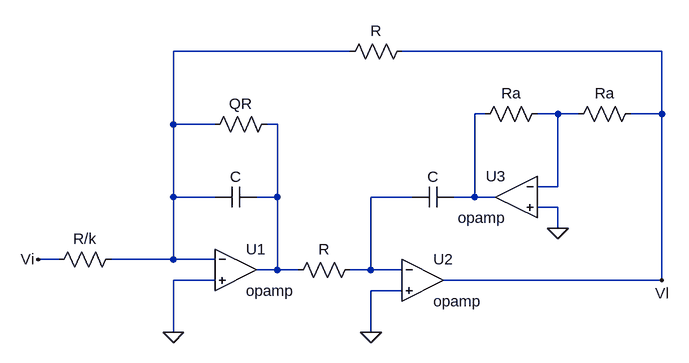
[diagram p0: schematic ackerberg_mossberg.asc]
ackerberg_mossberg.asc, the LTspice schematic file:
Version 4
SHEET 1 880 680
WIRE 192 -144 -80 -144
WIRE 672 -144 272 -144
WIRE 400 -48 384 -48
WIRE 512 -48 480 -48
WIRE 544 -48 512 -48
WIRE 672 -48 672 -144
WIRE 672 -48 624 -48
WIRE -80 -32 -80 -144
WIRE -16 -32 -80 -32
WIRE 80 -32 64 -32
WIRE 512 64 512 -48
WIRE 512 64 480 64
WIRE -80 80 -80 -32
WIRE -16 80 -80 80
WIRE 80 80 80 -32
WIRE 80 80 48 80
WIRE 288 80 224 80
WIRE 384 80 384 -48
WIRE 384 80 352 80
WIRE 416 80 384 80
WIRE 512 96 480 96
WIRE 512 128 512 96
WIRE -256 176 -288 176
WIRE -80 176 -80 80
WIRE -80 176 -176 176
WIRE -16 176 -80 176
WIRE 80 192 80 80
WIRE 80 192 48 192
WIRE 112 192 80 192
WIRE 224 192 224 80
WIRE 224 192 192 192
WIRE 272 192 224 192
WIRE -16 208 -80 208
WIRE 672 208 672 -48
WIRE 672 208 336 208
WIRE 272 224 224 224
WIRE -80 288 -80 208
WIRE 224 288 224 224
FLAG 224 288 0
FLAG -80 288 0
FLAG 672 208 Vl
FLAG -288 176 Vi
FLAG 512 128 0
SYMBOL Opamps\\opamp 16 128 R0
SYMATTR InstName U1
SYMBOL Opamps\\opamp 304 144 R0
SYMATTR InstName U2
SYMBOL Opamps\\opamp 448 16 M0
SYMATTR InstName U3
SYMBOL cap 48 64 R90
WINDOW 0 0 32 VBottom 2
WINDOW 3 32 32 VTop 2
SYMATTR InstName C
SYMATTR Value ""
SYMBOL res 80 -48 R90
WINDOW 0 0 56 VBottom 2
WINDOW 3 32 56 VTop 2
SYMATTR InstName QR
SYMATTR Value ""
SYMBOL res -160 160 R90
WINDOW 0 0 56 VBottom 2
WINDOW 3 32 56 VTop 2
SYMATTR InstName R/k
SYMATTR Value ""
SYMBOL res 208 176 R90
WINDOW 0 0 56 VBottom 2
WINDOW 3 32 56 VTop 2
SYMATTR InstName R
SYMATTR Value ""
SYMBOL res 496 -64 R90
WINDOW 0 0 56 VBottom 2
WINDOW 3 32 56 VTop 2
SYMATTR InstName Ra
SYMATTR Value ""
SYMBOL res 640 -64 R90
WINDOW 0 0 56 VBottom 2
WINDOW 3 32 56 VTop 2
SYMATTR InstName Ra
SYMATTR Value ""
SYMBOL res 288 -160 R90
WINDOW 0 0 56 VBottom 2
WINDOW 3 32 56 VTop 2
SYMATTR InstName R
SYMATTR Value ""
SYMBOL cap 352 64 R90
WINDOW 0 0 32 VBottom 2
WINDOW 3 32 32 VTop 2
SYMATTR InstName C
SYMATTR Value ""

The netlist it stands for:
* ackerberg_mossberg.asc
XU1 N001 0 N004 opamp Aol=100K GBW=10Meg  ; pins invin noninvin out
XU2 N005 0 Vl opamp Aol=100K GBW=10Meg  ; pins invin noninvin out
XU3 N003 0 N002 opamp Aol=100K GBW=10Meg  ; pins invin noninvin out
C N004 N001
R§QR N004 N001
R/k N001 Vi
R N005 N004
Ra N003 N002
Ra Vl N003
R Vl N001
C N002 N005
.backanno
.end